# Altium project PLC_Relay.PrjPcb
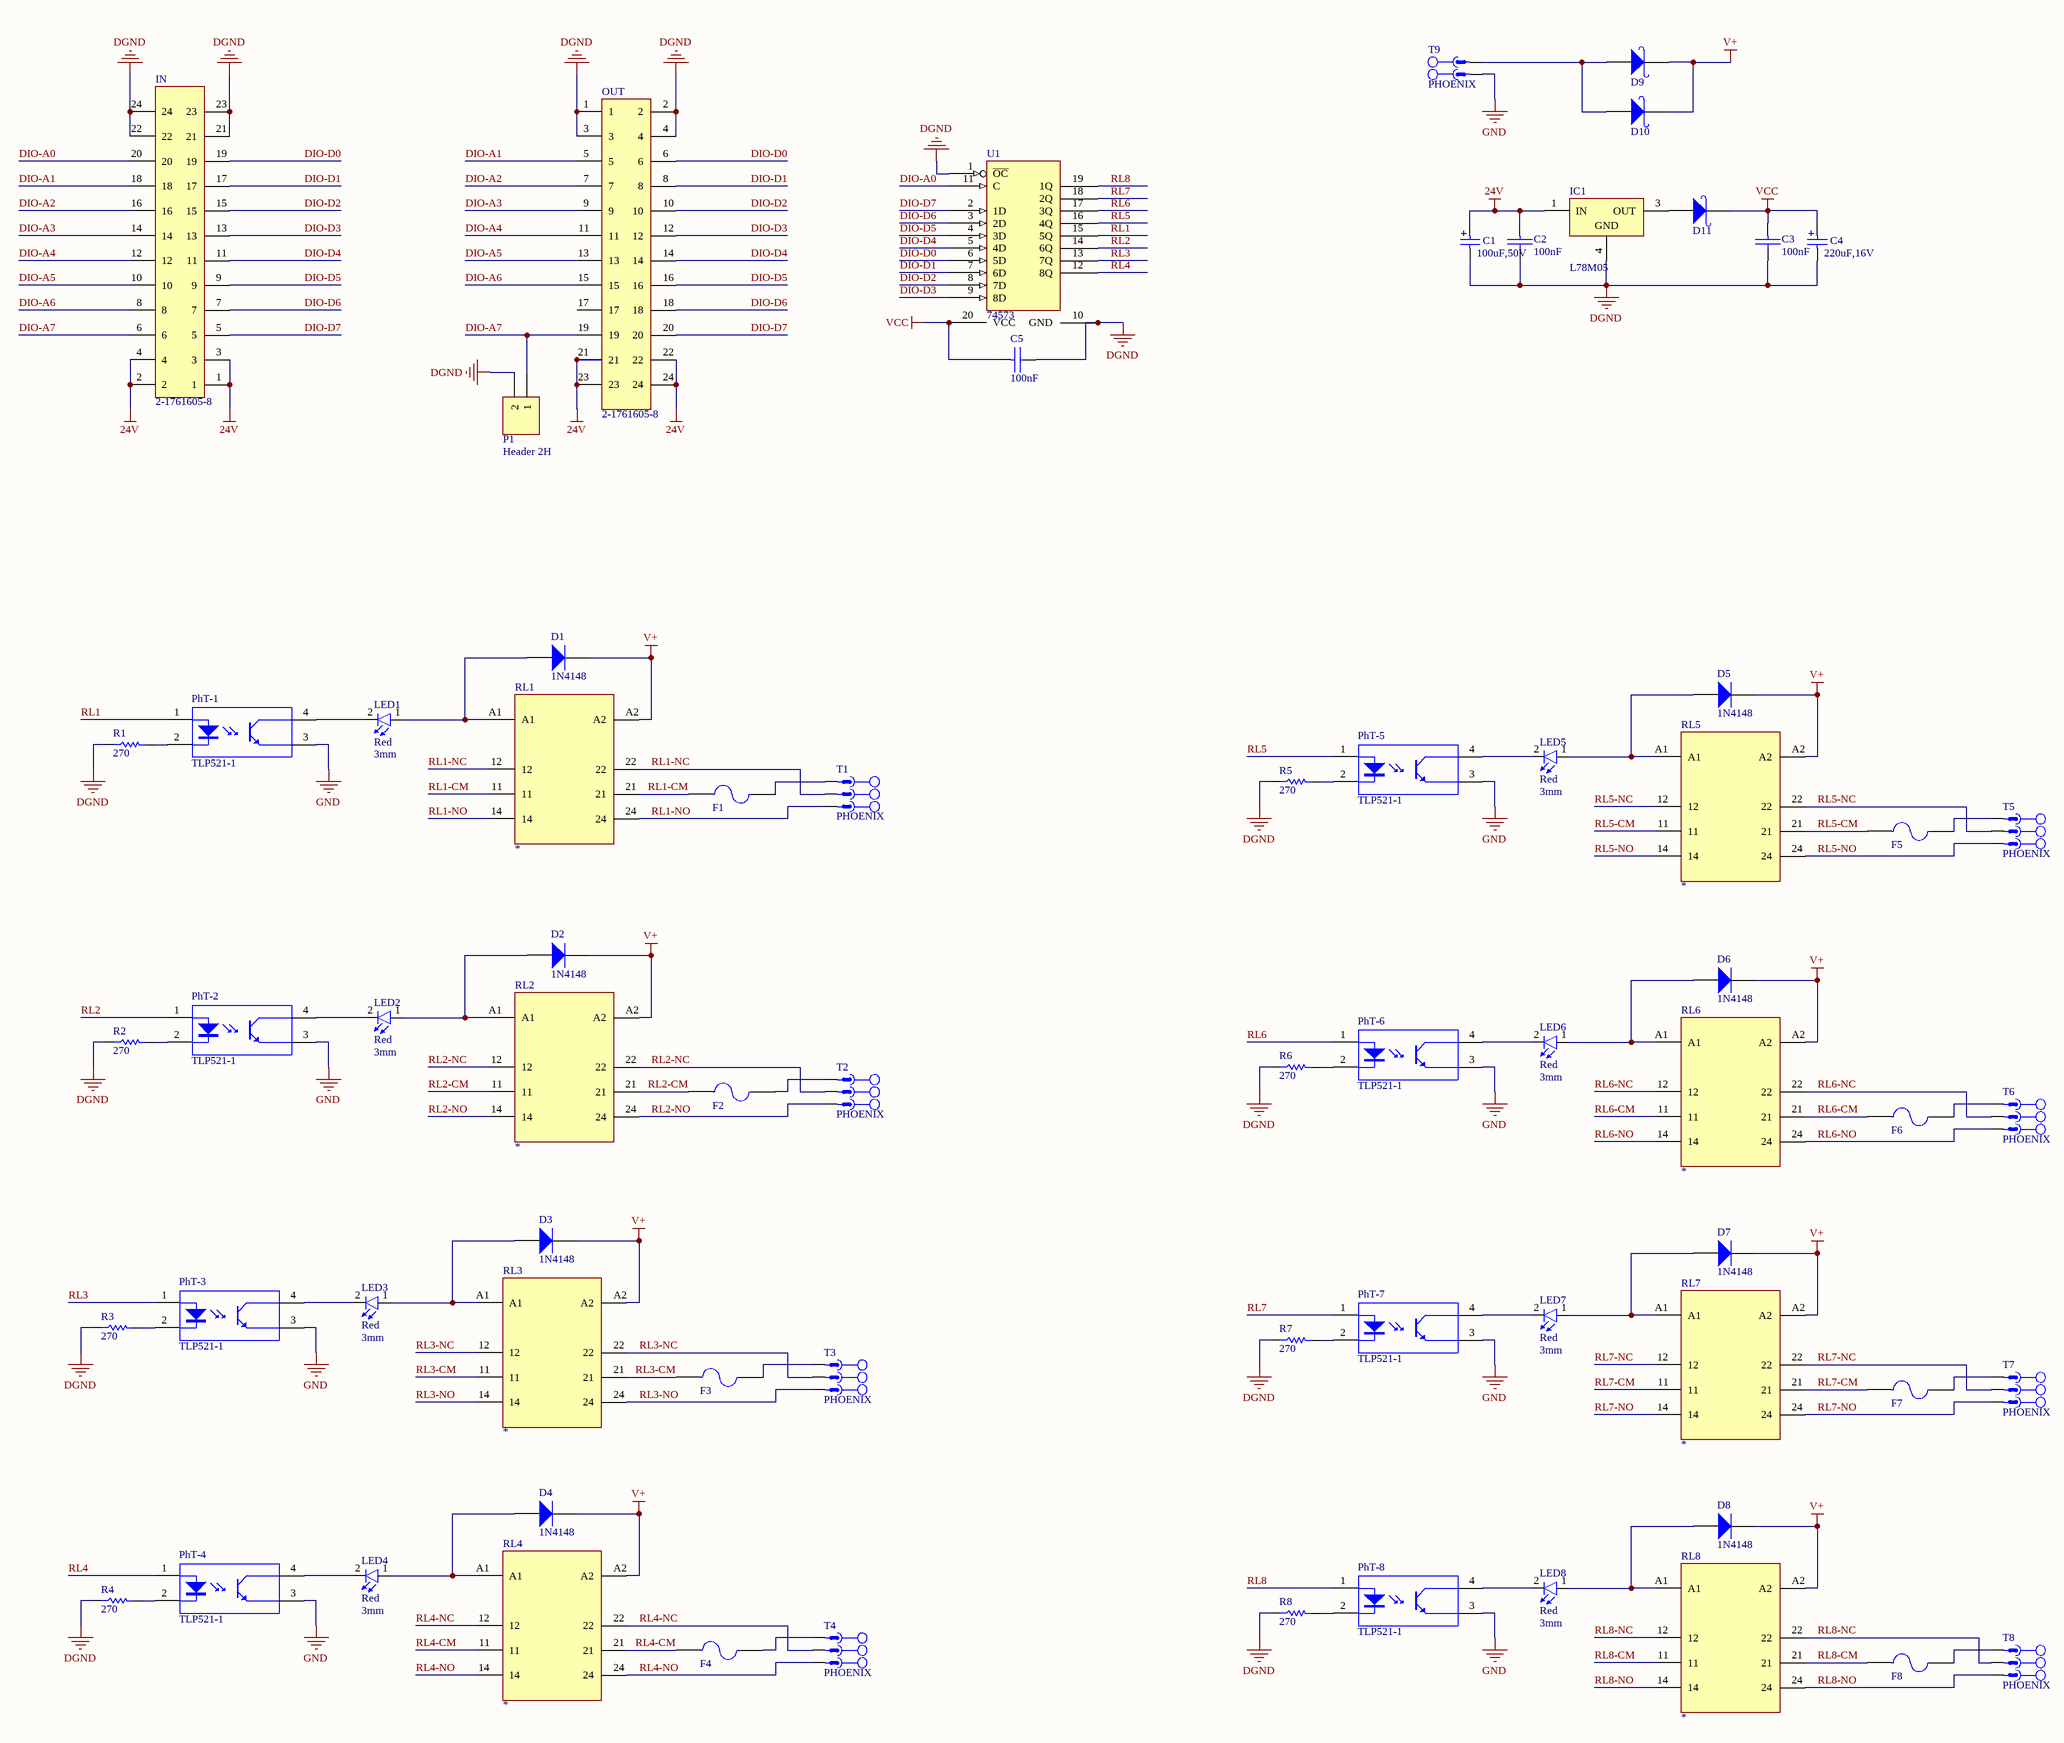
[diagram p0: PLC_Relay.SchDoc]
1 sheet, 70 parts. Net scope: global (net labels, ports and power ports of the same name join across sheets).
Board file: PLC_Relay.PcbDoc

## Sheet PLC_Relay.SchDoc
size A2

### Parts
C1  100uF,50V  [WCAP-AS5H_8x10.5]
C2  100nF  [SMD_CAP_0805]
C3  100nF  [SMD_CAP_0805]
C4  220uF,16V  [WCAP-AS5H_6.3x7.7]
C5  100nF  [SMD_CAP_0805]
D1  1N4148  [LL4148]
D2  1N4148  [LL4148]
D3  1N4148  [LL4148]
D4  1N4148  [LL4148]
D5  1N4148  [LL4148]
D6  1N4148  [LL4148]
D7  1N4148  [LL4148]
D8  1N4148  [LL4148]
D9  1n5822  [Diode 1N4007 SMD]  (value not drawn)
D10  1n5822  [Diode 1N4007 SMD]  (value not drawn)
D11  1n5822  [Diode 1N4007 SMD]  (value not drawn)
F1  F=1.0 A  [Fuse_5x20]  (value not drawn)
F2  F=1.0 A  [Fuse_5x20]  (value not drawn)
F3  F=1.0 A  [Fuse_5x20]  (value not drawn)
F4  F=1.0 A  [Fuse_5x20]  (value not drawn)
F5  F=1.0 A  [Fuse_5x20]  (value not drawn)
F6  F=1.0 A  [Fuse_5x20]  (value not drawn)
F7  F=1.0 A  [Fuse_5x20]  (value not drawn)
F8  F=1.0 A  [Fuse_5x20]  (value not drawn)
IC1  L78M05  [TO-252]
IN  2-1761605-8  [TE_2-1761605-8]
LED1  Size: 3mm  [LED-3mm]  (hidden comment: Red)
LED2  Size: 3mm  [LED-3mm]  (hidden comment: Red)
LED3  Size: 3mm  [LED-3mm]  (hidden comment: Red)
LED4  Size: 3mm  [LED-3mm]  (hidden comment: Red)
LED5  Size: 3mm  [LED-3mm]  (hidden comment: Red)
LED6  Size: 3mm  [LED-3mm]  (hidden comment: Red)
LED7  Size: 3mm  [LED-3mm]  (hidden comment: Red)
LED8  Size: 3mm  [LED-3mm]  (hidden comment: Red)
OUT  2-1761605-8  [TE_2-1761605-8]
P1  Header 2H  [HDR1X2H]
PhT-1  TLP521-1  [PCBComponent_1]
PhT-2  TLP521-1  [PCBComponent_1]
PhT-3  TLP521-1  [PCBComponent_1]
PhT-4  TLP521-1  [PCBComponent_1]
PhT-5  TLP521-1  [PCBComponent_1]
PhT-6  TLP521-1  [PCBComponent_1]
PhT-7  TLP521-1  [PCBComponent_1]
PhT-8  TLP521-1  [PCBComponent_1]
R1  270  [RES 0805 (2012X06L)]
R2  270  [RES 0805 (2012X06L)]
R3  270  [RES 0805 (2012X06L)]
R4  270  [RES 0805 (2012X06L)]
R5  270  [RES 0805 (2012X06L)]
R6  270  [RES 0805 (2012X06L)]
R7  270  [RES 0805 (2012X06L)]
R8  270  [RES 0805 (2012X06L)]
RL1  MPJ2-S-124-C  [RELAY_RT424024]  (value not drawn)
RL2  MPJ2-S-124-C  [RELAY_RT424024]  (value not drawn)
RL3  MPJ2-S-124-C  [RELAY_RT424024]  (value not drawn)
RL4  MPJ2-S-124-C  [RELAY_RT424024]  (value not drawn)
RL5  MPJ2-S-124-C  [RELAY_RT424024]  (value not drawn)
RL6  MPJ2-S-124-C  [RELAY_RT424024]  (value not drawn)
RL7  MPJ2-S-124-C  [RELAY_RT424024]  (value not drawn)
RL8  MPJ2-S-124-C  [RELAY_RT424024]  (value not drawn)
T1  PHOENIX  [MSTB 2,5/3-G-5,08]
T2  PHOENIX  [MSTB 2,5/3-G-5,08]
T3  PHOENIX  [MSTB 2,5/3-G-5,08]
T4  PHOENIX  [MSTB 2,5/3-G-5,08]
T5  PHOENIX  [MSTB 2,5/3-G-5,08]
T6  PHOENIX  [MSTB 2,5/3-G-5,08]
T7  PHOENIX  [MSTB 2,5/3-G-5,08]
T8  PHOENIX  [MSTB 2,5/3-G-5,08]
T9  PHOENIX  [MSTB 2,5/2-G-5,08]
U1  74573  [SO20_M]

### Nets
24V: C1.2(P) C2.2(-) IC1.1(IN) IN.1 IN.2 IN.3 IN.4 OUT.21 OUT.22 OUT.23 OUT.24
DGND: C1.1(N) C2.1(+) C3.1(+) C4.1(N) C5.1(+) IC1.4(GND) IN.21 IN.22 IN.23 IN.24 OUT.1 OUT.2 OUT.3 OUT.4 P1.2 PhT-1.3(E) PhT-2.3(E) PhT-3.3(E) PhT-4.3(E) PhT-5.3(E) PhT-6.3(E) PhT-7.3(E) PhT-8.3(E) R1.1 R2.1 R3.1 R4.1 R5.1 R6.1 R7.1 R8.1 T9.1 U1.1(~{OC}) U1.10(GND)  [also labelled GND]
V+: D1.2(K) D2.2(K) D3.2(K) D4.2(K) D5.2(K) D6.2(K) D7.2(K) D8.2(K) D9.2(K) D10.2(K) RL1.A2 RL2.A2 RL3.A2 RL4.A2 RL5.A2 RL6.A2 RL7.A2 RL8.A2
VCC: C3.2(-) C4.2(P) C5.2(-) D11.2(K) U1.20(VCC)
DIO-A0: IN.20 U1.11(C)
DIO-A1: IN.18 OUT.5
DIO-A2: IN.16 OUT.7
DIO-A3: IN.14 OUT.9
DIO-A4: IN.12 OUT.11
DIO-A5: IN.10 OUT.13
DIO-A6: IN.8 OUT.15
DIO-A7: IN.6 OUT.19 P1.1
DIO-D0: IN.19 OUT.6 U1.6(5D)
DIO-D1: IN.17 OUT.8 U1.7(6D)
DIO-D2: IN.15 OUT.10 U1.8(7D)
DIO-D3: IN.13 OUT.12 U1.9(8D)
DIO-D4: IN.11 OUT.14 U1.5(4D)
DIO-D5: IN.9 OUT.16 U1.4(3D)
DIO-D6: IN.7 OUT.18 U1.3(2D)
DIO-D7: IN.5 OUT.20 U1.2(1D)
RL1: PhT-1.1(A) U1.15(5Q)
RL1-CM: F1.1 RL1.11 RL1.21
RL1-NC: RL1.12 RL1.22 T1.2
RL1-NO: RL1.14 RL1.24 T1.3
RL2: PhT-2.1(A) U1.14(6Q)
RL2-CM: F2.1 RL2.11 RL2.21
RL2-NC: RL2.12 RL2.22 T2.2
RL2-NO: RL2.14 RL2.24 T2.3
RL3: PhT-3.1(A) U1.13(7Q)
RL3-CM: F3.1 RL3.11 RL3.21
RL3-NC: RL3.12 RL3.22 T3.2
RL3-NO: RL3.14 RL3.24 T3.3
RL4: PhT-4.1(A) U1.12(8Q)
RL4-CM: F4.1 RL4.11 RL4.21
RL4-NC: RL4.12 RL4.22 T4.2
RL4-NO: RL4.14 RL4.24 T4.3
RL5: PhT-5.1(A) U1.16(4Q)
RL5-CM: F5.1 RL5.11 RL5.21
RL5-NC: RL5.12 RL5.22 T5.2
RL5-NO: RL5.14 RL5.24 T5.3
RL6: PhT-6.1(A) U1.17(3Q)
RL6-CM: F6.1 RL6.11 RL6.21
RL6-NC: RL6.12 RL6.22 T6.2
RL6-NO: RL6.14 RL6.24 T6.3
RL7: PhT-7.1(A) U1.18(2Q)
RL7-CM: F7.1 RL7.11 RL7.21
RL7-NC: RL7.12 RL7.22 T7.2
RL7-NO: RL7.14 RL7.24 T7.3
RL8: PhT-8.1(A) U1.19(1Q)
RL8-CM: F8.1 RL8.11 RL8.21
RL8-NC: RL8.12 RL8.22 T8.2
RL8-NO: RL8.14 RL8.24 T8.3
NetD1_1: D1.1(A) LED1.1(A) RL1.A1
NetD2_1: D2.1(A) LED2.1(A) RL2.A1
NetD3_1: D3.1(A) LED3.1(A) RL3.A1
NetD4_1: D4.1(A) LED4.1(A) RL4.A1
NetD5_1: D5.1(A) LED5.1(A) RL5.A1
NetD6_1: D6.1(A) LED6.1(A) RL6.A1
NetD7_1: D7.1(A) LED7.1(A) RL7.A1
NetD8_1: D8.1(A) LED8.1(A) RL8.A1
NetD9_1: D9.1(A) D10.1(A) T9.2
NetD11_1: D11.1(A) IC1.3(OUT)
NetF1_2: F1.2 T1.1
NetF2_2: F2.2 T2.1
NetF3_2: F3.2 T3.1
NetF4_2: F4.2 T4.1
NetF5_2: F5.2 T5.1
NetF6_2: F6.2 T6.1
NetF7_2: F7.2 T7.1
NetF8_2: F8.2 T8.1
NetLED1_2: LED1.2(K) PhT-1.4(C)
NetLED2_2: LED2.2(K) PhT-2.4(C)
NetLED3_2: LED3.2(K) PhT-3.4(C)
NetLED4_2: LED4.2(K) PhT-4.4(C)
NetLED5_2: LED5.2(K) PhT-5.4(C)
NetLED6_2: LED6.2(K) PhT-6.4(C)
NetLED7_2: LED7.2(K) PhT-7.4(C)
NetLED8_2: LED8.2(K) PhT-8.4(C)
NetPhT-1_2: PhT-1.2(K) R1.2
NetPhT-2_2: PhT-2.2(K) R2.2
NetPhT-3_2: PhT-3.2(K) R3.2
NetPhT-4_2: PhT-4.2(K) R4.2
NetPhT-5_2: PhT-5.2(K) R5.2
NetPhT-6_2: PhT-6.2(K) R6.2
NetPhT-7_2: PhT-7.2(K) R7.2
NetPhT-8_2: PhT-8.2(K) R8.2

Not connected (* = marked no-connect by the designer): OUT 17

### Library data of the parts
C1 = 865230653012: WCAP-AS5H SMT Aluminum Electrolytic Capacitors, D8mm x L10.5mm, 47uF, +/-20%, 50VDC; Dissipation Factor: 12%; Endurance: 5000h; Leakage Current: 23.5uA; Ripple Current max.: 95mA; Technical Reference: ASDE105470M050DVCTEE000; ComponentLink1Description: Manufacturer; ComponentLink1URL: http://www.we-online.de; ComponentLink2Description: Datasheet; ComponentLink2URL: https://katalog.we-online.com/pbs/datasheet/865230653012.pdf; Length: 10.5mm; Mounting Technology: SMT; Operating Temperature: -40 to +105degC; Packaging: Tape and Reel; Published Date: August 2019; Capacitance: 47uF; Diameter: 8mm; Part Number: 865230653012; Publisher: Wurth Elektronik; Capacitance Tolerance: +/-20%; Rated Voltage: 50VDC
C2 C3 C5 = Cap-Bipolar: Bipolar Capacitor; Voltage: 100V; Designer: Saeid Jorablo; Organazation: ControTec; Adding Date: 1387/12/20; Value: 100nF
C4 = 865230345005: WCAP-AS5H SMT Aluminum Electrolytic Capacitors, D6.3mm x L7.7mm, 100uF, +/-20%, 16VDC; Dissipation Factor: 22%; Endurance: 5000h; Leakage Current: 16uA; Ripple Current max.: 81mA; Technical Reference: ASDD077101M016DVCTCE000; ComponentLink1Description: Manufacturer; ComponentLink1URL: http://www.we-online.de; ComponentLink2Description: Datasheet; ComponentLink2URL: https://katalog.we-online.com/pbs/datasheet/865230345005.pdf; Length: 7.7mm; Mounting Technology: SMT; Operating Temperature: -40 to +105degC; Packaging: Tape and Reel; Published Date: August 2019; Capacitance: 100uF; Diameter: 6.3mm; Part Number: 865230345005; Publisher: Wurth Elektronik; Capacitance Tolerance: +/-20%; Rated Voltage: 16VDC
D1-D8 = Diode 1N4148: High Conductance Fast Diode; Published: 8-Jun-2000; LatestRevisionDate: 17-Jul-2002; LatestRevisionNote: Re-released for DXP Platform.; DatasheetVersion: 1997; PackageReference: DO-35; Publisher: Altium Limited; PackageDescription: Diode, Axial; Body 3.8 x 1.9 mm (LxDia. max), Lead Dia. 0.53 mm (max); Code_JEDEC: DO-204-AH; ComponentLink1Description: Manufacturer Link; ComponentLink1URL: http://www.fairchildsemi.com/; ComponentLink2Description: Datasheet; ComponentLink2URL: http://www.fairchildsemi.com/ds/1N%2F1N4148.pdf
D9-D11 = 1N5822 SMD: Schottky Rectifiers; Part. No: SS34; Manufacturer: ON Semiconductor/Fairchild; Designer: Abbas Basereh; Link: https://www.aliexpress.com/item/Free-shipping-100pcs-1n5822-sma-smd-do-214ac-Schottky-diode-ss34/32337482329.html?spm=2114.01010208.3.1.zLZDsP&ws_ab_test=searchweb0_0,searchweb201602_4_10065_10068_10084_10083_10080_10082_10081_10060_10061_10062_10056_10055_10054_10059_10099_10078_10079_427_10073_10103_10102_10096_10052_10050_10051,searchweb201603_4&btsid=6e50dc92-ac69-45bc-a19e-209af19ce602; Link: http://www.tme.eu/en/details/ss34/smd-schottky-diodes/vishay/ss34-e357t/; Link: http://www.digikey.com/product-detail/en/on-semiconductor-fairchild/SS34/SS34FSCT-ND/2094459; Data: 16-12-2016
F1-F8 = Fuse 5x20 with holdeer pins: Fuses 5x20; Designer: Abbas Basereh; Desc.: fuse with holder pins 5x20; Data: 28-12-2016
IC1 = L78M05: Precision 500mA Regulator
IN OUT = 2-1761605-8: IDC LOW PRO HDR 64P RA BLUE; Package: None; Price: None; Value: *; MP: 2-1761605-8; Availability: Unavailable
LED1-LED8 = LED: Designer: Saeid Jorablo; Organazation: ControTec; Adding Date: 1387/12/22; Color: Red
P1 = Header 2H: Header, 2-Pin, Right Angle; LatestRevisionDate: 17-Jul-2002; LatestRevisionNote: Re-released for DXP Platform.; Publisher: Altium Limited
R1-R8 = Resistor: Tolerance: 5%; Power: 1/8 W; Value: 270
RL1-RL8 = RT424024: General Purpose Relay DPDT _2 Form C_ 24VDC Coil Through Hole; MF: TE Connectivity; MP: RT424024; Value: *; SnapEDA_Link: https://www.snapeda.com/parts/RT424024/TE%20Connectivity%20Potter%20%26%20Brumfield%20Relays/view-part/2754819/?ref=snap; Package: None; Availability: Unavailable; TE_purchase_URL: https://www.te.com/usa-en/product-6-1393243-8.html?te_bu=Cor&te_type=disp&te_campaign=seda_glo_cor-seda-global-disp-prtnr-fy19-seda-model-bom-cta_sma-317_1&elqCampaignId=32493; Price: None; Comment_1: *
T1-T8 = CON_Phoenix_MSTB_03: 3 Pitch: 5.08 mm Color: green Contact surface: Tin Assembly; Manufacturer: PHOENIX CONTACT; Connector type: PCB Terminal Block; designer: ABBAS BASEREH; Max Current: 12 A; Positions: 3; Voltage: 320 V; Category: Connector; ComponentLink1Description: Header, Nominal current: 12 A Rated voltage (III/2): 320 V Number of positions: 3 Pitch: 5.08 mm Color: green Contact surface: Tin Assembly: Soldering  DESIGNER:ABBAS BASEREH; ComponentLink2Description: Reference; Mounting Technology: Through-Hole; Pin Count: 3; Revision 1: 2017-3-1; Status: Unreleased; PART.NO: PHOENIX
T9 = CON_Phoenix_MSTB_02: 2 Pitch: 5.08 mm Color: green Contact surface: Tin Assembly; Manufacturer: PHOENIX CONTACT; Connector type: PCB Terminal Block; designer: ABBAS BASEREH; Max Current: 12 A; Positions: 2; Voltage: 320 V; Category: Connector; ComponentLink1Description: Header, Nominal current: 12 A Rated voltage (III/2): 320 V Number of positions: 2 Pitch: 5.08 mm Color: green Contact surface: Tin Assembly: Soldering  DESIGNER:ABBAS BASEREH; ComponentLink2Description: Reference; Mounting Technology: Through-Hole; Pin Count: 2; Revision 1: 2017-3-1; Status: Unreleased; PART.NO: PHOENIX
U1 = 74573: OCTAL D-TYPE TRANSPARENT LCH